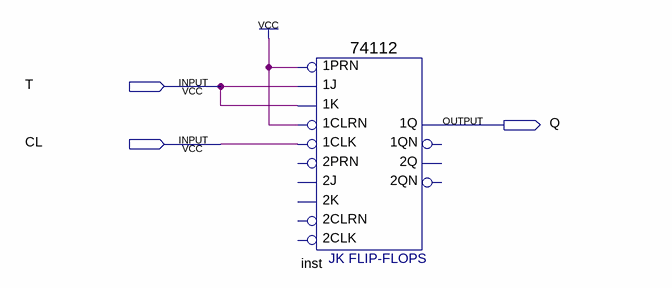
[diagram p0: schematic sheet]
// Quartus schematic problem5.bdf as structural Verilog: 1 symbols, 3 pins
module problem5 (
  input  T,
  input  CL,
  output Q
);

  \74112  inst (
    .\1K (T), .\1J (T), .\1PRN (1'b1), .\1CLK (CL), .\1CLRN (1'b1), .\1Q (Q));  // open: 2K, 2J, 2PRN, 2CLK, 2CLRN, 1QN, 2Q, 2QN
endmodule
